# EAGLE schematic TPS61230 v1.1 (EAGLE 6.5.0)
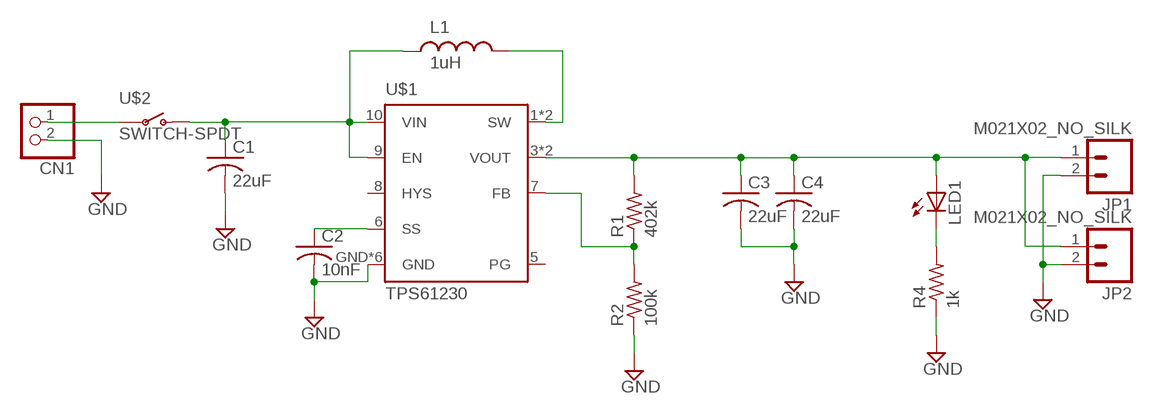
[diagram p0: schematic, sheet 1]

## Parts
C1  22uF  C-USC0603K  [C0603K]
C2  10nF  C-USC0603K  [C0603K]
C3  22uF  C-USC0603K  [C0603K]
C4  22uF  C-USC0603K  [C0603K]
CN1  JST_2PIN-SMT-RA  [JST-PH-2-SMT-RA]
JP1  M021X02_NO_SILK  [1X02_NO_SILK]
JP2  M021X02_NO_SILK  [1X02_NO_SILK]
L1  1uH  XFL4020  [XFL4020]
LED1  LEDCHIPLED_0603  [CHIPLED_0603]
R1  402k  R-US_R0603  [R0603]
R2  100k  R-US_R0603  [R0603]
R4  1k  R-US_R0603  [R0603]
U$1  TPS61230  [DRC-S-PVSON-N11]
U$2  SWITCH-SPDT  [JS102011]

## Nets
GND: C1.2 C2.2 C3.2 C4.2 CN1.2 JP1.2 JP2.2 R2.1 R4.1 U$1.GND U$1.GND@1(GND) U$1.GND@2(GND) U$1.GND@3(GND) U$1.GND@4(GND) U$1.GND@5(GND)
IND: L1.P$2 U$1.1(SW) U$1.2(SW)
N$2: LED1.C R4.2
N$3: C2.1 U$1.6(SS)
N$6: R1.1 R2.2 U$1.7(FB)
N$7: CN1.1 U$2.P$3(P)
VIN: C1.1 L1.P$1 U$1.9(EN) U$1.10(VIN) U$2.P$2(O)
VOUT: C3.1 C4.1 JP1.1 JP2.1 LED1.A R1.2 U$1.3(VOUT) U$1.4(VOUT)
Unconnected: U$1.8(HYS)

## Power pins joined to a net without a drawn wire
PG: U$1.5(PG)

## Library data of the parts
C1-C4 = adafruit:C-US: CAPACITOR, American symbol
CN1 = adafruit:JST_2PIN: JST 2-Pin Connectors of various flavors SMT-RA (S2B-PH-SM4) 4UConnector #17311 SMT (B2B-PH-SM4) THM-RA (S2B-PH) THM (B2B-PH)
JP1 JP2 = SparkFun-Connectors:M02: Standard 2-pin 0.1" header. Use with - straight break away headers ( PRT-00116) - right angle break away headers (PRT-00553) - swiss pins (PRT-00743) - machine pins (PRT-00117) - female headers (PRT-00115) Molex polarized connector foot print use with: PRT-08233 with associated crimp pins and housings. 2.54_SCREWTERM for use with PRT-10571. 3.5mm Screw Terminal footprints for PRT-08084 5mm Screw Terminal footprints for use with PRT-08433
L1 = Coilcraft:XFL4020
LED1 = adafruit:LED: LED OSRAM: - CHIPLED LG R971, LG N971, LY N971, LG Q971, LY Q971, LO R971, LY R971 LH N974, LH R974 LS Q976, LO Q976, LY Q976 LO Q996 - Hyper CHIPLED LW Q18S LB Q993, LB Q99A, LB R99A - SideLED LS A670, LO A670, LY A670, LG A670, LP A670 LB A673, LV A673, LT A673, LW A673 LH A674 LY A675 LS A676, LA A676, LO A676, LY A676, LW A676 LS A679, LY A679, LG A679 - Hyper Micro SIDELED® LS Y876, LA Y876, LO Y876, LY Y876 LT Y87S - SmartLED LW L88C, LW L88S LB L89C, LB L89S, LG L890 LS L89K, LO L89K, LY L89K LS L896, LA L896, LO L896, LY L896 - TOPLED LS T670, LO T670, LY T670, LG T670, LP T670 LSG T670, LSP T670, LSY T670, LOP T670, LYG T670 LG T671, LOG T671, LSG T671 LB T673, LV T673, LT T673, LW T673 LH T674 LS T676, LA T676, LO T676, LY T676, LB T676, LH T676, LSB T676, LW T676 LB T67C, LV T67C, LT T67C, LS T67K, LO T67K, LY T67K, LW E67C LS E67B, LA E67B, LO E67B, LY E67B, LB E67C, LV E67C, LT E67C LW T67C LS T679, LY T679, LG T679 LS T770, LO T770, LY T770, LG T770, LP T770 LB T773, LV T773, LT T773, LW T773 LH T774 LS E675, LA E675, LY E675, LS T675 LS T776, LA T776, LO T776, LY T776, LB T776 LHGB T686 LT T68C, LB T68C - Hyper Mini TOPLED® LB M676 - Mini TOPLED Santana® LG M470 LS M47K, LO M47K, LY M47K Source: http://www.osram.convergy.de/
R1 R2 R4 = adafruit:R-US_: RESISTOR, American symbol
U$1 = texas:TPS61230
U$2 = C&K Components:SWITCH-SPDT